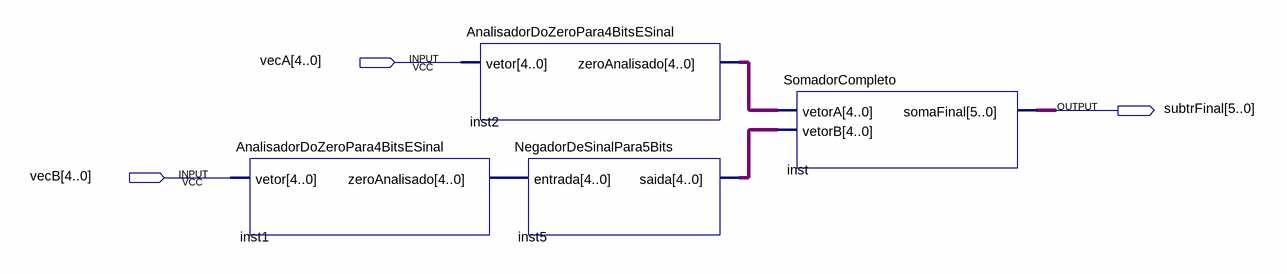
[diagram p0: schematic sheet]
// Quartus schematic SubtratorCompleto.bdf as structural Verilog: 4 symbols, 3 pins
module SubtratorCompleto (
  input  [4:0] vecA,
  input  [4:0] vecB,
  output [5:0] subtrFinal
);

  wire [4:0] inst1_zeroanalisado, inst2_zeroanalisado, inst5_saida;

  AnalisadorDoZeroPara4BitsESinal inst1 (.vetor(vecB), .zeroAnalisado(inst1_zeroanalisado));
  AnalisadorDoZeroPara4BitsESinal inst2 (.vetor(vecA), .zeroAnalisado(inst2_zeroanalisado));
  NegadorDeSinalPara5Bits inst5 (.entrada(inst1_zeroanalisado), .saida(inst5_saida));
  SomadorCompleto inst (.vetorA(inst2_zeroanalisado), .vetorB(inst5_saida), .somaFinal(subtrFinal));
endmodule
